# Altium schematic sheet schem.SchDoc
size A4; Organization: Altium Limited; Address1: L3, 12a Rodborough Rd; Address2: Frenchs Forest; Address3: NSW; Address4: Australia 2086
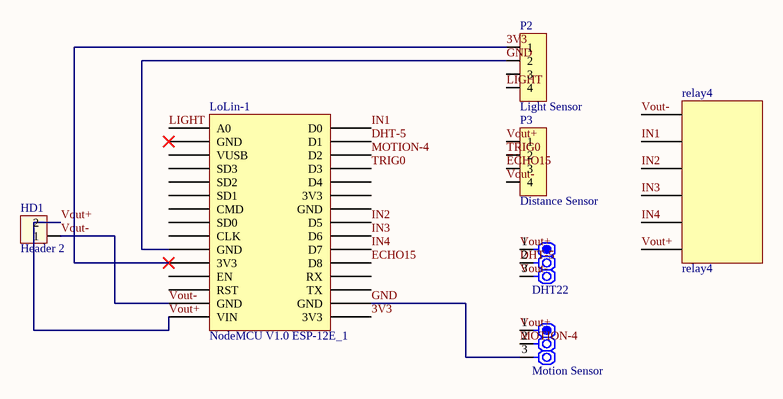
[diagram p0: schem.SchDoc]

## Parts
DHT22  IO  [CON.HDR1X3]  (value not drawn)
HD1  Header 2  [HED2]
LoLin-1  NodeMCU V1.0 ESP-12E_1  [LoLin NodeMcu V3]
Motion_Sensor  IO  [CON.HDR1X3]  (value not drawn)
P2  Light Sensor  [CON Header 4]
P3  Distance Sensor  [CON Header 4]
relay4  relay4  [PCBComponent_1]

## Nets
3V3: LoLin-1.3V3 P2.1
DHT-5: DHT22.2 LoLin-1.D1
ECHO15: LoLin-1.D8 P3.3
GND: LoLin-1.GND Motion_Sensor.3 P2.2
IN1: LoLin-1.D0 relay4.IN1
IN2: LoLin-1.D5 relay4.IN2
IN3: LoLin-1.D6 relay4.IN3
IN4: LoLin-1.D7 relay4.IN4
LIGHT: LoLin-1.A0 P2.4
MOTION-4: LoLin-1.D2 Motion_Sensor.2
TRIG0: LoLin-1.D3 P3.2
Vout+: DHT22.1 HD1.2 LoLin-1.VIN Motion_Sensor.1 P3.1 relay4.VCC
Vout-: DHT22.3 HD1.1 LoLin-1.GND P3.4 relay4.GND

Not connected (* = marked no-connect by the designer): LoLin-1 CLK CMD D4 EN RST RX SD0 SD1 SD2 SD3 TX VUSB; P2 3

## Notes on the sheet
- Title
- Size:
- Date:
- A4
- Number:
- Time:
- Revision:
- Sheet
- of
- File:

## Library data of the parts
DHT22 Motion_Sensor = CON.HDR1x3: Header 1x3; Publisher: Hoang Nguyen; ComponentLink1Description: Digikey Part link; ComponentLink2Description: Open DataSheet; ComponentLink2URL: H:\LIBRARY\LIBRARY.Datasheet\
HD1 = Hed2: Header 2 (Green); Value: Header 2
LoLin-1 = NodeMCU V1.0 ESP-12E_1: LoLin NodeMCU V3
P2 P3 = Header 4: Header, 4-Pin